# Altium schematic sheet Pruebaesquem.SchDoc
size A4; SheetNumber: 13; SheetTotal: 13
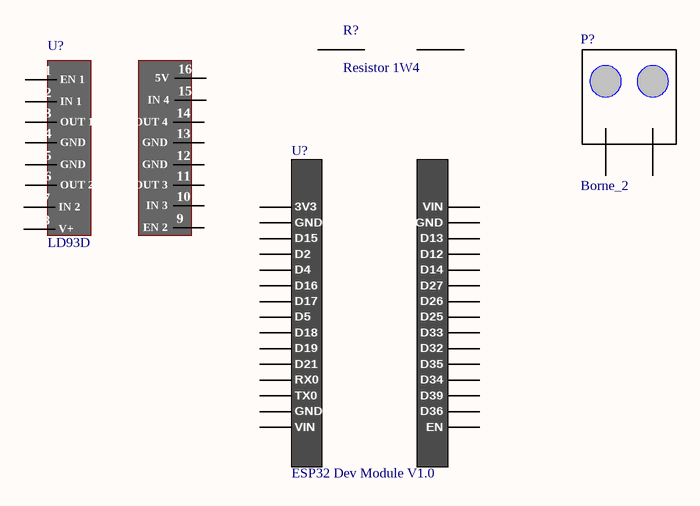
[diagram p0: Pruebaesquem.SchDoc]

## Parts
(Parts that share a designator on the sheet are numbered #1, #2 ... from top to bottom, then left to right.)
P?  Borne_2  [PCBComponent_1]
R?  Resistor 1W4  [PCBComponent_1]
U?#1  LD93D  [PCBComponent_1]
U?#2  ESP32 Dev Module V1.0  [ESP32 Dev Kit V1.0]

## Nets

Not connected (* = marked no-connect by the designer): P? 1 2; R? 1 2; U?#1 1(EN_1) 2(IN_1) 3(OUT_1) 4(GND) 5(GND) 6(OUT_2) 7(IN_2) 8(V+) 9(EN_2) 10(IN_3) 11(OUT_3) 12(GND) 13(GND) 14(OUT_4) 15(IN_4) 16(5V); U?#2 1(3V3) 2(GND) 3(D15) 4(D2) 5(D4) 6(D16) 7(D17) 8(D5) 9(D18) 10(D19) 11(D21) 12(RX0) 13(TX0) 14(GND) 15(VIN) 16(EN) 17(D36) 18(D39) 19(D34) 20(D35) 21(D32) 22(D33) 23(D25) 24(D26) 25(D27) 26(D14) 27(D12) 28(D13) 29(GND) 30(VIN)

## Library data of the parts
P? = Borne_2: Borne de dos pines
U?#1 = LD93D: THT DIP 16
U?#2 = ESP32 Dev Module V.1: Development kit V1.0, ESP32-D0WD-V3, ESP32 ECO V3, 4 MB SPI flash, PCB antenna; Manufacturer: Espressif Systems; Manufacturer Part Number: ESP32-WROOM-32E(M113EH3200PH3Q0); Supplier: Digi-Key; Supplier Part Number: 1965-ESP32-WROOM-32E-N4TR-ND; RoHS: No; Category: RF Receivers, Transceivers; Pricing: 650=2.5 (USD)